# EAGLE design A4a NodeMCU (EAGLE 9.6.2)
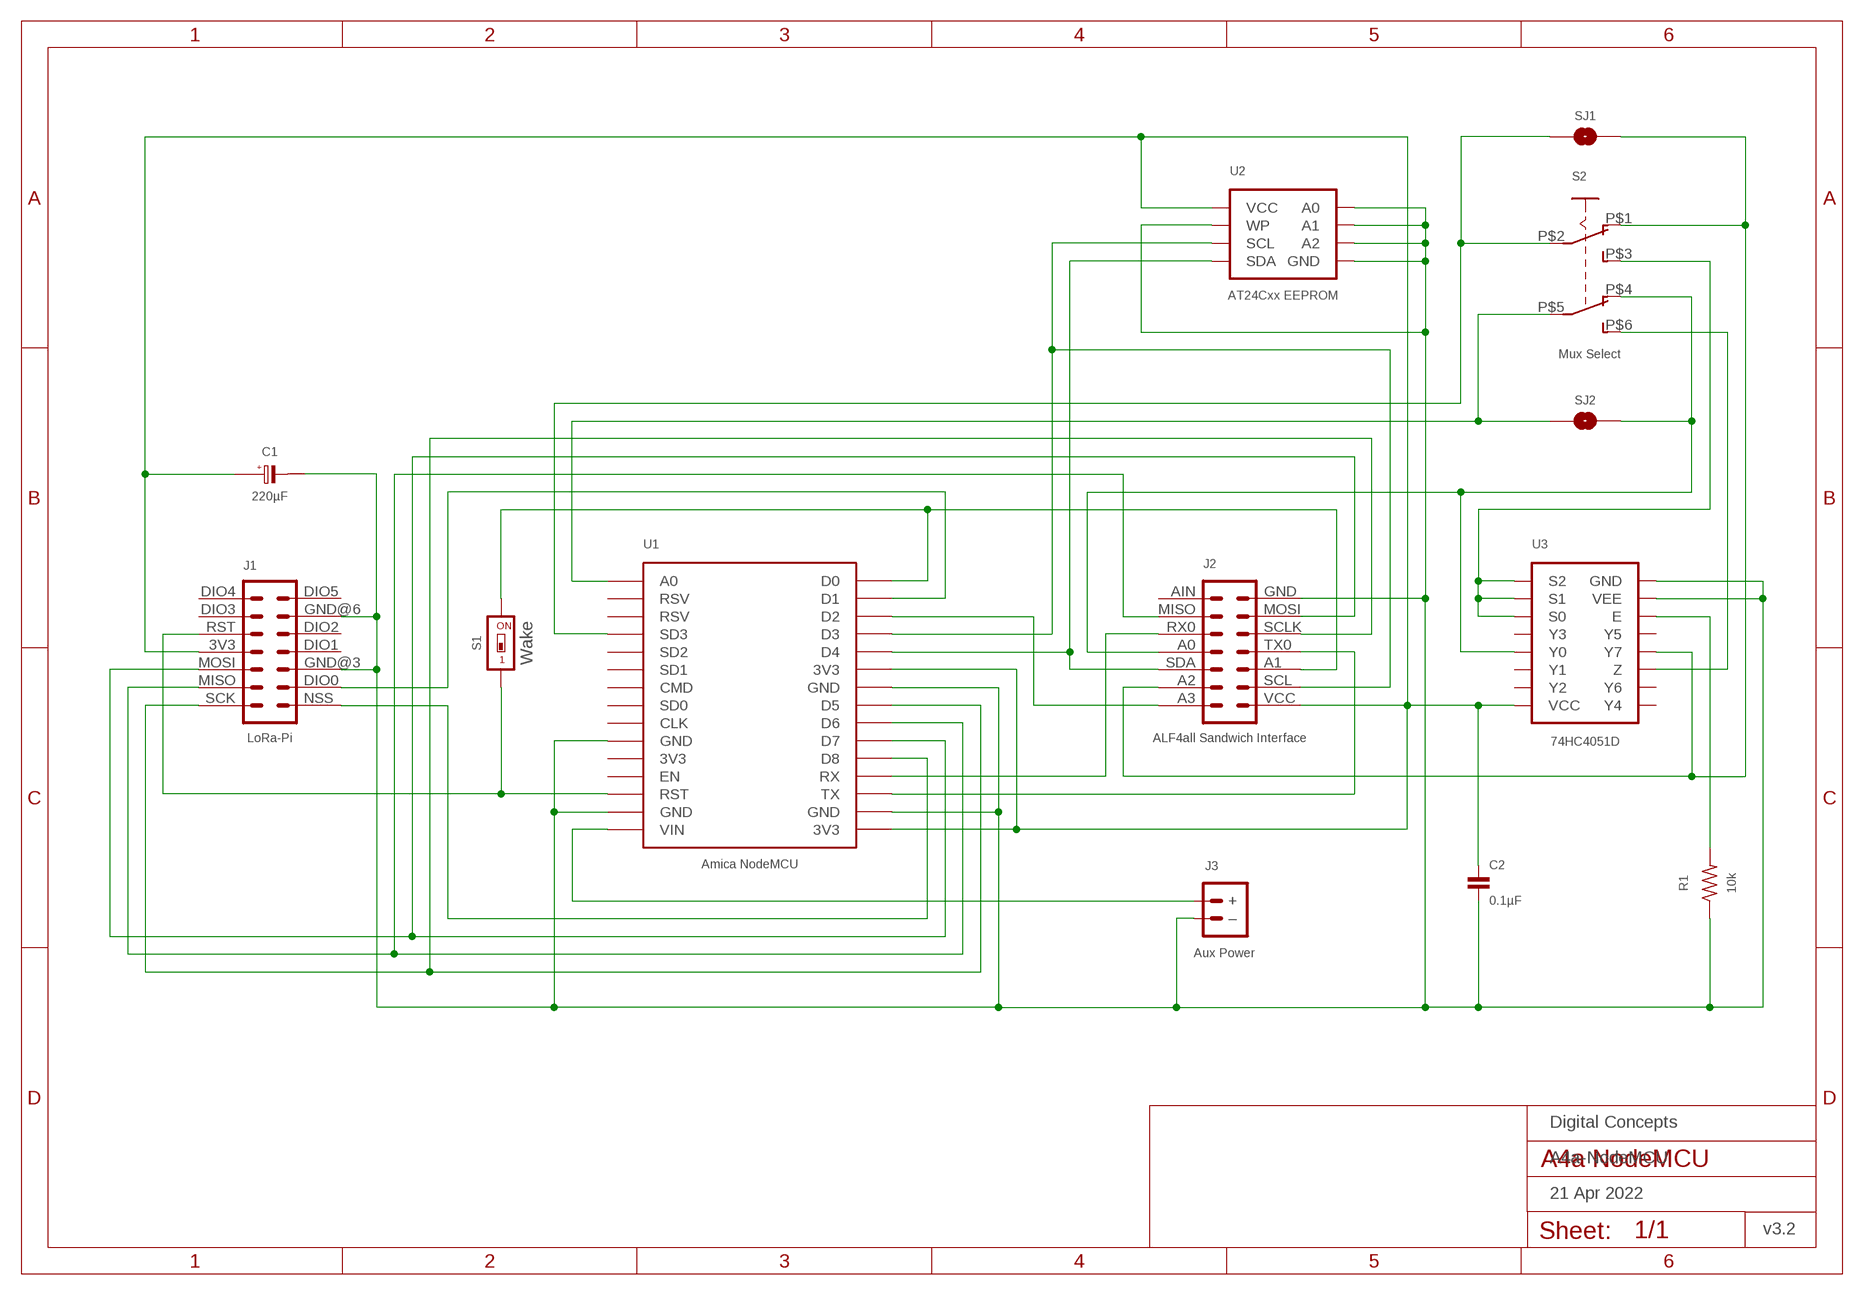
[diagram p0: schematic, sheet 1]
FRAME1 (A4L-LOC): DATE: 21 Apr 2022; OWNER: Digital Concepts; TITLE: A4a-NodeMCU; VERSION: v3.2

## Parts
C1  220µF  CAPACITOR-TANTALUM-3528  [C3528-21]
C2  0.1µF  CAPACITOR-0805  [C0805]
J1  LoRa-Pi  RFM95W-PI-HEADER  [RFM95W-PI]
J2  ALF4all Sandwich Interface  HEADER-2X7-ALF4ALL-PROCESSOR-B  [CONN_2X7-ALF4ALL-PROCESSOR-B]
J3  Aux Power  JST-PH2.0-2-MALE-HORIZONTALJST-PTH-2  [JST-PH2.0-2-HORIZONTAL]
R1  10k  RESISTORR0805  [R0805]
S1  Wake  SWITCH-DIP-SWS001  [SMD-001]
S2  Mux Select  SWITCH-DPDT  [SWITCH-DPDT-SMD]
SJ1  SJ  [SJ]
SJ2  SJ  [SJ]
U1  Amica NodeMCU  AMICA-NODEMCU  [AMICA-NODEMCU]
U2  AT24Cxx EEPROM  AT24CXX-EEPROM  [SOP-8]
U3  74HC4051D  [SOP16]

## Nets
GND: C1.2(-) C2.2 J1.GND@3 J1.GND@6 J2.GND J3.-(–) R1.1 U1.GND@2(GND) U1.GND@9(GND) U1.GND@25(GND) U1.GND@29(GND) U2.P$1(A0) U2.P$2(A1) U2.P$3(A2) U2.P$4(GND) U2.P$7(WP) U3.7(VEE) U3.8(GND)
N$1: S2.P$5(P2) SJ2.1 U1.A0
N$2: J2.A3 U1.D2
N$3: J2.A1 S1.2 U1.D0
N$4: J1.RST S1.1 U1.RST
N$5: J2.A0 S2.P$4(O2) SJ2.2 U3.13(Y0)
N$6: J1.SCK J2.SCLK U1.D5
N$7: J2.RX0 U1.RX
N$8: R1.2 U3.6(E)
N$9: J3.+ U1.VIN
N$10: J2.SDA U1.D4 U2.P$5(SDA)
N$11: J2.SCL U1.D3 U2.P$6(SCL)
N$12: J1.MISO J2.MISO U1.D6
N$13: J1.MOSI J2.MOSI U1.D7
N$14: J2.TX0 U1.TX
N$15: J1.NSS U1.D8
N$16: S2.P$3(S1) U3.9(S2) U3.10(S1) U3.11(S0)
N$17: J1.DIO0 U1.D1
N$18: S2.P$2(P1) SJ1.1 U1.SD3
N$19: S2.P$6(S2) U3.3(Z)
N$20: J2.A2 S2.P$1(O1) SJ1.2 U3.4(Y7)
VCC: C1.1(+) C2.1 J1.3V3 J2.VCC U1.3V3@1(3V3) U1.3V3@10(3V3) U2.P$8(VCC) U3.16(VCC)
Unconnected: J1.DIO1 J1.DIO2 J1.DIO3 J1.DIO4 J1.DIO5 J2.AIN U1.3V3@26(3V3) U1.CLK U1.CMD U1.EN U1.RSV@17(RSV) U1.RSV@18(RSV) U1.SD0 U1.SD1 U1.SD2 U3.1(Y4) U3.2(Y6) U3.5(Y5) U3.12(Y3) U3.14(Y1) U3.15(Y2)

## Library data of the parts
C1 = digitalconcepts:CAPACITOR-TANTALUM-3528: Capacitor Polarised EIA 3528-21 (KEMET B)
C2 = digitalconcepts:CAPACITOR-0805: 0805 Capacitor
J1 = digitalconcepts:RFM95W-PI-HEADER: RFM95W LoRa Wireless Transceiver Raspberry Pi Daughter Board
J2 = digitalconcepts:HEADER-2X7-ALF4ALL-PROCESSOR-B: ALF4all 'Sandwich' Processor (Bottom) 2x7 Pin Header Header soldered to underside of PCB
J3 = digitalconcepts:JST-PH2.0-2-MALE-HORIZONTAL: Multi connection point. Often used as Generic Header-pin footprint for 0.1 inch spaced/style header connections On any of the 0.1 inch spaced packages, you can populate with these: Break Away Headers - Straight <https://www.sparkfun.com/products/116> (PRT-00116) Break Away Male Headers - Right Angle <https://www.sparkfun.com/products/553> (PRT-00553) Female Headers <https://www.sparkfun.com/products/115> (PRT-00115) Break Away Headers - Machine Pin <https://www.sparkfun.com/products/117> (PRT-00117) Break Away Female Headers - Swiss Machine Pin <https://www.sparkfun.com/products/743> (PRT-00743) For SCREWTERMINALS and SPRING TERMINALS visit here: Screw Terimnals on SparkFun.com <https://www.sparkfun.com/search/results?term=Screw+Terminals> (5mm/3.5mm/2.54mm spacing) This device is also useful as a general connection point to wire up your design to another part of your project. Our various solder wires solder well into these plated through hole pads. Hook-Up Wire - Assortment (Stranded, 22 AWG) <https://www.sparkfun.com/products/11375> (PRT-11375) Hook-Up Wire - Assortment (Solid Core, 22 AWG) <https://www.sparkfun.com/products/11367> (PRT-11367) View the entire wire category on our website here <https://www.sparkfun.com/categories/141> Special notes: Molex polarized connector foot print use with: PRT-08233 with associated crimp pins and housings. 2.54_SCREWTERM for use with PRT-10571. 3.5mm Screw Terminal footprints for PRT-08084 5mm Screw Terminal footprints for use with PRT-08432; PROD_ID: CONN-09863; SKU: PRT-09914
R1 = digitalconcepts:RESISTOR: Resistor; SPICEPREFIX: R
S1 = digitalconcepts:SWITCH-DIP-SWS001: SMD Dip Switch 1 pol.
S2 = digitalconcepts:SWITCH-DPDT: Switch SMD DPDT
SJ1 SJ2 = digitalconcepts:SJ: Solder Jumper
U1 = digitalconcepts:AMICA-NODEMCU: Amica NodeMCU Development Board
U2 = digitalconcepts:AT24CXX-EEPROM: AT24Cxx EEPROM SOP-8
U3 = digitalconcepts:74HC4051D: 74HC4051 8-Port Multiplexer SOP-16

## Board
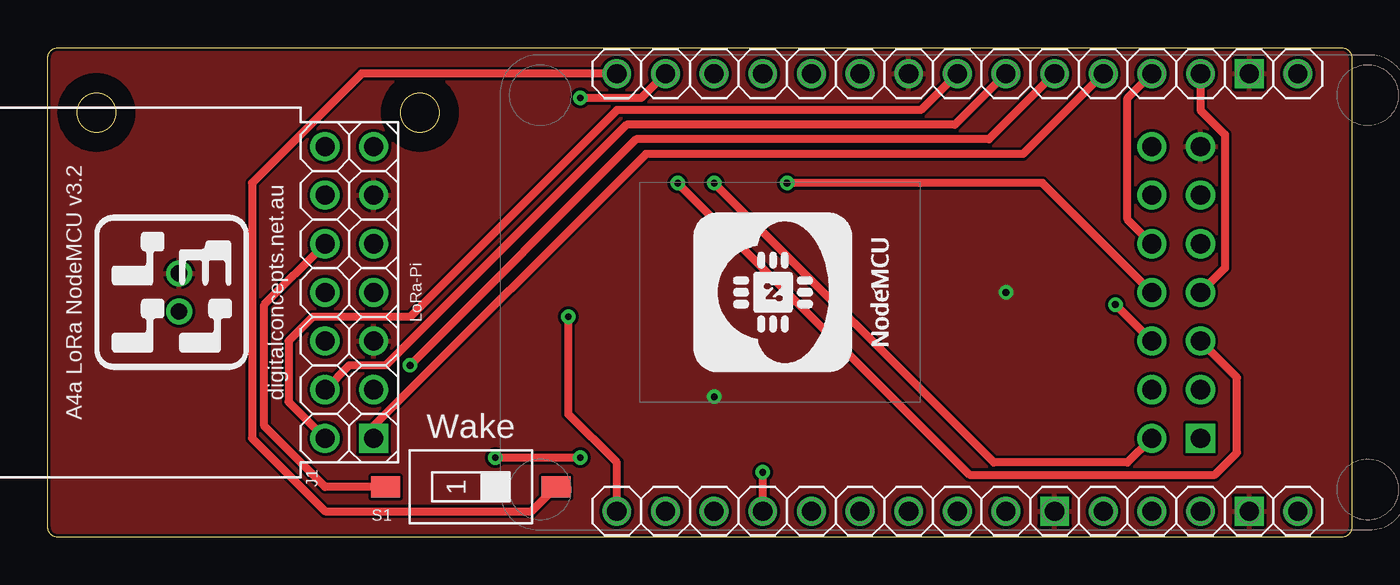
[diagram p1: board, top side]
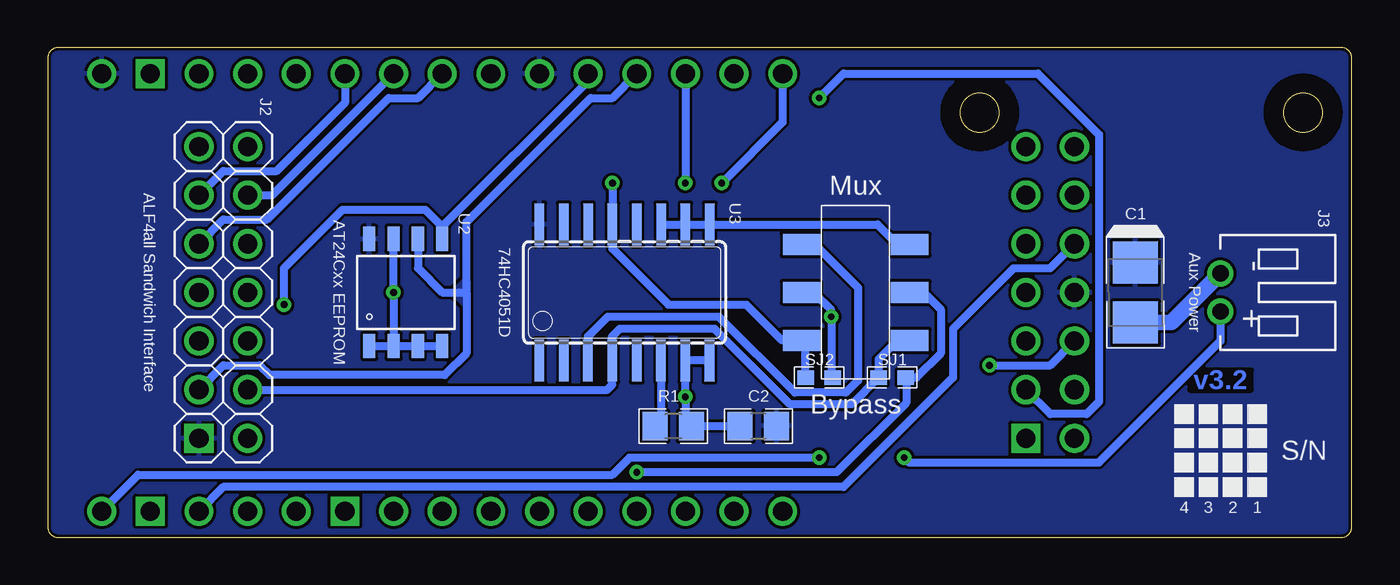
[diagram p2: board, bottom side, seen from below]

Size 68.08 x 25.56 mm. Coordinates in mm from the lower left corner, seen from the top.
Outline: 67.62,25.56 67.65,25.56 67.69,25.55 67.72,25.54 67.75,25.53 67.78,25.52 67.81,25.51 67.84,25.49 67.86,25.48 67.89,25.46 67.91,25.44 67.93,25.41 67.96,25.39 67.98,25.37 67.99,25.34 68.01,25.31 68.03,25.28 68.05,25.22 68.06,25.19 68.07,25.16 68.08,25.13 68.08,25.1 68.08,0.47 68.08,0.43 68.07,0.4 68.06,0.37 68.05,0.33 68.03,0.28 68.01,0.25 67.99,0.22 67.98,0.19 67.96,0.17 67.93,0.15 67.91,0.12 67.89,0.1 67.86,0.09 67.84,0.07 67.81,0.05 67.78,0.04 67.75,0.03 67.72,0.02 67.69,0.01 67.65,0 67.62,0 0.46,0 0.42,0 0.39,0.01 0.36,0.02 0.33,0.03 0.27,0.05 0.24,0.07 0.22,0.09 0.19,0.1 0.17,0.12 0.14,0.15 0.12,0.17 0.1,0.19 0.08,0.22 0.07,0.25 0.05,0.28 0.04,0.31 0.03,0.33 0.02,0.37 0.01,0.4 0,0.43 0,0.47 0,25.1 0,25.13 0.01,25.16 0.02,25.19 0.03,25.22 0.04,25.25 0.05,25.28 0.07,25.31 0.08,25.34 0.1,25.37 0.12,25.39 0.17,25.44 0.19,25.46 0.22,25.48 0.24,25.49 0.27,25.51 0.33,25.53 0.36,25.54 0.39,25.55 0.42,25.56 0.46,25.56 67.62,25.56
Outline: circle at 19.42,22.18 radius 1.02
Outline: circle at 2.53,22.18 radius 1.02
Copper layers (1*16): Top 0.035mm / dielectric 1.5mm / Bottom 0.035mm
Design rules "default *": minimum track width 6mil, minimum drill 0.35mm, track to track 6mil, track to pad 6mil, pad to pad 6mil, via to via 6mil, smd to smd 6mil, copper to edge 6mil, drill to drill 6mil, minimum pad ring 10mil, minimum via ring 8mil, stop-mask expansion 4mil, vias tented up to drill 0mil, thermal gap 6mil

### Footprints (pad centres in the part's own frame; a part is rotated, then mirrored left to right if it is on the bottom)
C3528-21 = smd 2.21 x 2.35: 1 -1.565,0; 2 1.565,0
C0805 = smd 1.3 x 1.5: 1 -0.95,0; 2 0.95,0
RFM95W-PI = drill 1 pad 1.524: 3V3 7.62,2.54; DIO0 2.54,0; DIO1 7.62,0; DIO2 10.16,0; DIO3 12.7,2.54; DIO4 15.24,2.54; DIO5 15.24,0; GND@3 5.08,0; GND@6 12.7,0; MISO 2.54,2.54; MOSI 5.08,2.54; RST 10.16,2.54; SCK 0,2.54 | drill 1 pad 1.524 square: NSS 0,0
CONN_2X7-ALF4ALL-PROCESSOR-B = drill 1 pad 1.524: A0 7.62,2.54; A1 5.08,0; A2 2.54,2.54; A3 0,2.54; AIN 15.24,2.54; GND 15.24,0; MISO 12.7,2.54; MOSI 12.7,0; RX0 10.16,2.54; SCL 2.54,0; SCLK 10.16,0; SDA 5.08,2.54; TX0 7.62,0 | drill 1 pad 1.524 square: VCC 0,0
JST-PH2.0-2-HORIZONTAL = drill 0.85: + 1,0; - -1,0
R0805 = smd 1.3 x 1.5: 1 -0.95,0; 2 0.95,0
SMD-001 = smd 1.1 x 1.5: 1 0,-4.45; 2 0,4.45
SWITCH-DPDT-SMD = smd 1.95 x 1.1: P$1 -2.825,2.5; P$2 -2.825,0; P$3 -2.825,-2.5; P$4 2.825,2.5; P$5 2.825,0; P$6 2.825,-2.5
SJ = smd 0.864 x 0.762: 1 -0.711,0; 2 0.711,0
AMICA-NODEMCU = drill 1: 3V3@1 0,0; 3V3@10 0,22.86; 3V3@26 -22.86,10.16; A0 -22.86,35.56; CLK -22.86,15.24; CMD -22.86,20.32; D0 0,35.56; D1 0,33.02; D2 0,30.48; D3 0,27.94; D4 0,25.4; D5 0,17.78; D6 0,15.24; D7 0,12.7; D8 0,10.16; EN -22.86,7.62; GND@9 0,20.32; RST -22.86,5.08; RSV@17 -22.86,33.02; RSV@18 -22.86,30.48; RX 0,7.62; SD0 -22.86,17.78; SD1 -22.86,22.86; SD2 -22.86,25.4; SD3 -22.86,27.94; TX 0,5.08; VIN -22.86,0 | drill 1 square: GND@2 0,2.54; GND@25 -22.86,12.7; GND@29 -22.86,2.54
SOP-8 = smd 0.635 x 1.27: P$1 -1.905,-2.794; P$2 -0.635,-2.794; P$3 0.635,-2.794; P$4 1.905,-2.794; P$5 1.905,2.794; P$6 0.635,2.794; P$7 -0.635,2.794; P$8 -1.905,2.794
SOP16 = smd 0.5 x 2.2: 1 -4.445,-3.55; 2 -3.185,-3.55; 3 -1.915,-3.55; 4 -0.645,-3.55; 5 0.635,-3.55; 6 1.895,-3.55; 7 3.165,-3.55; 8 4.435,-3.55; 9 4.445,3.55; 10 3.175,3.55; 11 1.905,3.55; 12 0.635,3.55; 13 -0.635,3.55; 14 -1.905,3.55; 15 -3.175,3.55; 16 -4.445,3.55

### Placement (x,y rotation side)
C1  11.29,12.78 270.1 bottom
C2  30.98,5.8 180 bottom
J1  17.01,5.16 90 top
J2  60.19,5.16 90 top
J3  6.85,12.78 270 bottom
R1  35.42,5.8 180 bottom
S1  22.09,2.62 270 top
S2  25.9,12.78 180 bottom
SJ1  23.99,8.34 180 bottom
SJ2  27.8,8.34 180 bottom
U1  65.27,24.21 90 top
U2  49.39,12.78 0 bottom
U3  37.96,12.78 0 bottom

### Tracks (layer width: path | path; a pad name or v marks a point on that pad's centre or on a via)
$X1
  cutout Top: 2.53,24.21 arc180 2.53,20.15 arc180
$X2
  cutout Bottom: 2.53,24.21 arc180 2.53,20.15 arc180
$X3
  cutout Top: 19.42,24.21 arc180 19.42,20.15 arc180
$X4
  cutout Bottom: 19.42,24.21 arc180 19.42,20.15 arc180
GND  (via drill 0.35)
  Bottom 0.406: U2.P$1 U2.P$2 | U2.P$7 v50.03,12.78 U2.P$2 | U3.8 U3.7 34.8,7.34 v34.79,7.33 34.79,6.11 R1.1 C2.2 | U2.P$2 U2.P$3 U2.P$4
  Bottom 0.813: C1.2 9.41,11.22 J3.-
  pour Top (rank 5): -2.04,27.39 70.35,27.39 70.35,-1.82 -2.04,-1.82
N$1  (via drill 0.35)
  Top 0.406: U1.A0 29.71,3.89 27.17,6.43 v27.17,11.51
  Bottom 0.406: S2.P$5 28.09,12.78 27.17,11.86 v27.17,11.51 27.17,8.41 SJ2.1
N$2  (via drill 0.35)
  Top 0.406: v34.79,18.5 49.39,3.89 56.38,3.89 J2.A3
  Bottom 0.406: U1.D2 v34.79,18.5
N$3  (via drill 0.35)
  Top 0.406: U1.D0 16.37,24.21 10.66,18.5 10.66,5.16 14.47,1.35 25.27,1.35 S1.2 | v32.88,18.5 48.12,3.26 60.95,3.26 62.09,4.41 62.09,8.34 J2.A1
  Bottom 0.406: U1.D0 29.71,21.67 v32.88,18.5
N$4
  Top 0.406: S1.1 14.47,2.62 11.29,5.8 11.29,12.15 J1.RST
  Bottom 0.406: U1.RST 58.92,2.62 26.53,2.62 20.82,8.34 20.82,10.88 17.64,14.05 15.74,14.05 J1.RST
N$5  (via drill 0.35)
  Top 0.406: J2.A0 51.93,18.5 v38.6,18.5
  Bottom 0.406: v38.6,18.5 U3.13 38.6,15.07 35.68,12.15 31.61,12.15 29.75,10.28 S2.P$4 28.51,10.07 SJ2.2
N$6
  Top 0.406: U1.D5 45.58,22.31 29.71,22.31 18.91,11.51 13.83,11.51 12.56,10.24 12.56,7.07 J1.SCK
  Bottom 0.406: J2.SCLK 58.92,16.59 56.63,16.59 50.28,22.94 48.76,22.94 U1.D5
N$7
  Top 0.406: U1.RX 56.38,22.94 56.38,16.59 J2.RX0
N$8
  Bottom 0.406: U3.6 36.07,6.1 R1.2
N$9  (via drill 0.35)
  Top 0.406: v27.8,4.15 v23.36,4.15
  Bottom 0.406: U1.VIN 63.36,3.26 38.6,3.26 37.71,4.15 v27.8,4.15 | J3.+ 6.85,10.24 13.2,3.89 23.1,3.89 v23.36,4.15
N$10  (via drill 0.35)
  Top 0.406: J2.SDA v55.74,12.15
  Bottom 0.406: U1.D4 39.87,23.83 47.49,16.21 | U2.P$5 47.49,16.21 | 47.49,16.21 48.38,17.1 52.7,17.1 55.74,14.05 v55.74,12.15
N$11
  Bottom 0.406: J2.SCL 58.92,8.97 57.01,8.97 56.51,8.46 47.36,8.46 46.22,9.61 46.22,12.78 | U2.P$6 48.76,14.05 47.49,12.78 46.22,12.78 | U1.D3 38.6,22.94 39.74,22.94 46.22,16.47 46.22,12.78
  pour Bottom: 46.85,12.78 46.22,13.42 46.22,12.15
N$12
  Top 0.406: U1.D6 47.36,21.55 30.22,21.55 17.64,8.97 15.74,8.97 J1.MISO
  Bottom 0.406: J2.MISO 56.38,17.86 U1.D6
N$13  (via drill 0.35)
  Top 0.406: U1.D7 49.14,20.78 30.72,20.78 v18.91,8.97
  Bottom 0.406: J2.MOSI 58.92,19.13 56.12,19.13 52.57,22.69 U1.D7 | v18.91,8.97 15.74,8.97 J1.MOSI
N$14
  Top 0.406: U1.TX 60.19,22.31 61.46,21.04 61.46,14.05 J2.TX0
N$15
  Top 0.406: U1.D8 50.92,20.02 31.23,20.02 17.01,5.8 J1.NSS
N$16
  Bottom 0.406: U3.11 U3.10 U3.9 24.76,16.33 23.71,15.28 S2.P$3
N$17  (via drill 0.35)
  Top 0.406: U1.D1 30.98,22.94 v27.8,22.94
  Bottom 0.406: J1.DIO0 15.74,6.43 13.83,6.43 13.2,7.07 13.2,21.04 16.37,24.21 26.53,24.21 v27.8,22.94
N$18  (via drill 0.35)
  Top 0.406: U1.SD3 v37.33,3.38
  Bottom 0.406: S2.P$2 22.34,12.78 21.45,11.89 21.45,9.61 22.72,8.34 SJ1.1 23.26,8.31 23.26,7.02 26.89,3.38 v37.33,3.38
N$19
  Bottom 0.406: U3.3 39.88,10.49 38.85,11.51 33.04,11.51 29.07,7.55 26.41,7.55 25.77,8.19 25.77,13.04 28.02,15.28 S2.P$6
N$20
  Bottom 0.406: J2.A2 38.87,7.7 38.61,7.96 U3.4 38.61,10.49 38.22,10.88 33.26,10.88 29.33,6.94 26.1,6.94 SJ1.2 24.7,9.29 23.71,10.28 S2.P$1
VCC
  pour Bottom (rank 5): -0.77,26.12 69.08,26.12 69.08,-0.55 -0.77,-0.55

### Text on the board
Bottom: v3.2
tPlace: A4a LoRa NodeMCU v3.2 | digitalconcepts.net.au
bPlace: S/N | 1 | 2 | 3 | 4
bNames: Mux | Bypass